# Altium schematic sheet Linear_Regulator.SchDoc
size A4; SheetNumber: 5; SheetTotal: 5
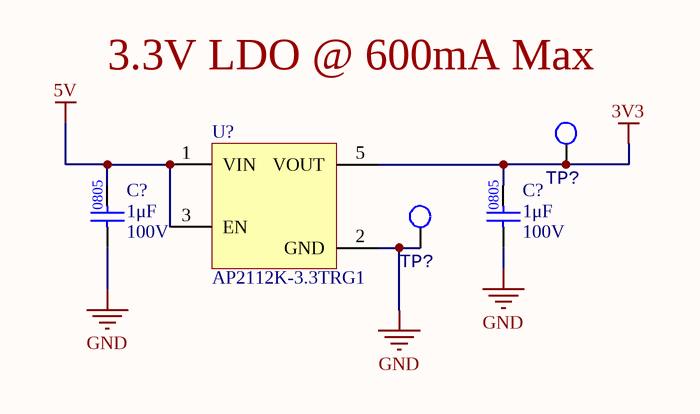
[diagram p0: Linear_Regulator.SchDoc]

## Parts
(Parts that share a designator on the sheet are numbered #1, #2 ... from top to bottom, then left to right.)
C?#1  value 1μF  Voltage Rating: 100V  [CAP0805]  (hidden comment: CAP_1uF_100V_0805)
C?#2  value 1μF  Voltage Rating: 100V  [CAP0805]  (hidden comment: CAP_1uF_100V_0805)
TP?#1  TESTPOINT_LOOP  [TESTPOINT_LOOP]  (value not drawn)
TP?#2  TESTPOINT_LOOP  [TESTPOINT_LOOP]  (value not drawn)
U?  Manufacturer Part Number 1: AP2112K-3.3TRG1  [SOT95P285X140-5N]  (hidden comment: LDO_3.3V_600mA)

## Nets
3V3: C?#2.2 TP?#1.1 U?.5(VOUT)
5V: C?#1.2 U?.1(VIN) U?.3(EN)
GND: C?#1.1 C?#2.1 TP?#2.1 U?.2(GND)

## Notes on the sheet
- 3.3V LDO @ 600mA Max

## Library data of the parts
C?#1 C?#2 = CAP_1uF_100V_0805: CAP CER 1UF 100V X7S 0805; Supplier 1: Digi-Key; Mounting Type: SMD; Package: 0805; Supplier Part Number 1: 490-14464-1-ND
TP?#1 TP?#2 = TESTPOINT_LOOP: TESTPOINT THRUHOLE; Manufacturer 1: Keystone Electronics; Manufacturer Part Number 1: 5002; Package/Footprint: TH; Supplier 1: Digi-Key; Supplier Part Number 1: 36-5002-ND; Mounting Type: TH
U? = LDO_3.3V_600mA: IC REG LINEAR 3.3V 600MA SOT25; Manufacturer 1: Diodes Incorporated; Input Voltage (Max): 6V; Voltage Dropout (Max): 0.4V; Package/Footprint: SOT-25; Supplier 1: Digi-Key; Supplier Part Number 1: AP2112K-3.3TRG1DICT-ND; Output Voltage (Fixed): 3.3V; Output Current: 600mA; Operating Temperature: -40°C - 85°C; LCSC Part #: C51118; Mounting Type: SMD